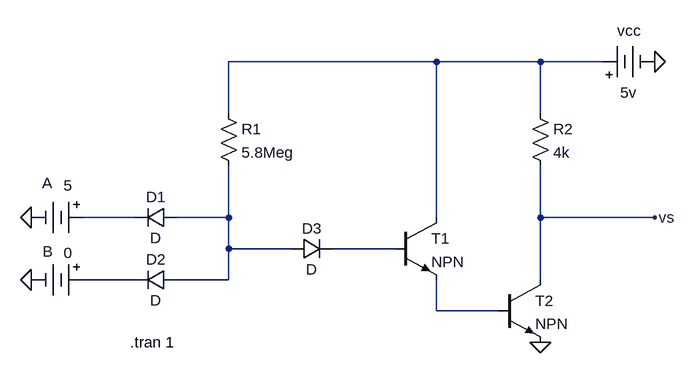
[diagram p0: schematic Draft11.asc]
Draft11.asc, the LTspice schematic file:
Version 4
SHEET 1 880 680
WIRE 320 -144 0 -144
WIRE 480 -144 320 -144
WIRE 576 -144 480 -144
WIRE 0 -64 0 -144
WIRE 480 -64 480 -144
WIRE -144 96 -224 96
WIRE 0 96 0 16
WIRE 0 96 -80 96
WIRE 320 96 320 -144
WIRE 480 96 480 16
WIRE 656 96 480 96
WIRE 0 144 0 96
WIRE 96 144 0 144
WIRE 256 144 160 144
WIRE -144 192 -224 192
WIRE 0 192 0 144
WIRE 0 192 -80 192
WIRE 480 192 480 96
WIRE 320 240 320 192
WIRE 416 240 320 240
FLAG 656 96 vs
FLAG 480 288 0
FLAG 656 -144 0
FLAG -304 96 0
FLAG -304 192 0
SYMBOL diode -80 80 R90
WINDOW 0 0 32 VBottom 2
WINDOW 3 32 32 VTop 2
SYMATTR InstName D1
SYMBOL diode -80 176 R90
WINDOW 0 0 32 VBottom 2
WINDOW 3 32 32 VTop 2
SYMATTR InstName D2
SYMBOL diode 96 160 R270
WINDOW 0 32 32 VTop 2
WINDOW 3 0 32 VBottom 2
SYMATTR InstName D3
SYMBOL res -16 -80 R0
SYMATTR InstName R1
SYMATTR Value 5.8Meg
SYMBOL res 464 -80 R0
SYMATTR InstName R2
SYMATTR Value 4k
SYMBOL npn 256 96 R0
SYMATTR InstName T1
SYMBOL npn 416 192 R0
SYMATTR InstName T2
SYMBOL Misc\\battery 560 -144 R270
WINDOW 0 32 56 VTop 2
WINDOW 3 -32 56 VBottom 2
SYMATTR InstName vcc
SYMATTR Value 5v
SYMBOL Misc\\battery -208 96 R90
WINDOW 0 -38 71 VBottom 2
WINDOW 3 -65 39 VTop 2
WINDOW 123 0 0 Left 0
WINDOW 39 0 0 Left 0
SYMATTR InstName A
SYMATTR Value 5
SYMBOL Misc\\battery -208 192 R90
WINDOW 0 -28 70 VBottom 2
WINDOW 3 -57 39 VTop 2
WINDOW 123 0 0 Left 0
WINDOW 39 0 0 Left 0
SYMATTR InstName B
SYMATTR Value 0
TEXT -152 288 Left 2 !.tran 1

The netlist it stands for:
* Draft11.asc
D1 N003 N002 D
D2 N003 N005 D
D3 N003 N004 D
R1 N001 N003 5.8Meg
R2 N001 vs 4k
Q§T1 N001 N004 N006 0 NPN
Q§T2 vs N006 0 0 NPN
vcc N001 0 5v
V§A N002 0 5
V§B N005 0 0
.model D D
.lib standard.dio
.model NPN NPN
.model PNP PNP
.lib standard.bjt
.tran 1
.backanno
.end